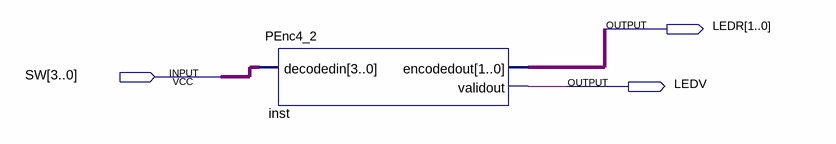
[diagram p0: schematic sheet]
// Quartus schematic PEnc4_2Demo.bdf as structural Verilog: 1 symbols, 3 pins
module PEnc4_2Demo (
  input  [3:0] SW,
  output [1:0] LEDR,
  output LEDV
);

  PEnc4_2 inst (.decodedin(SW), .encodedout(LEDR), .validout(LEDV));
endmodule
